# Altium schematic sheet BMS Master.SchDoc
size A4; SheetNumber: 1; SheetTotal: 6
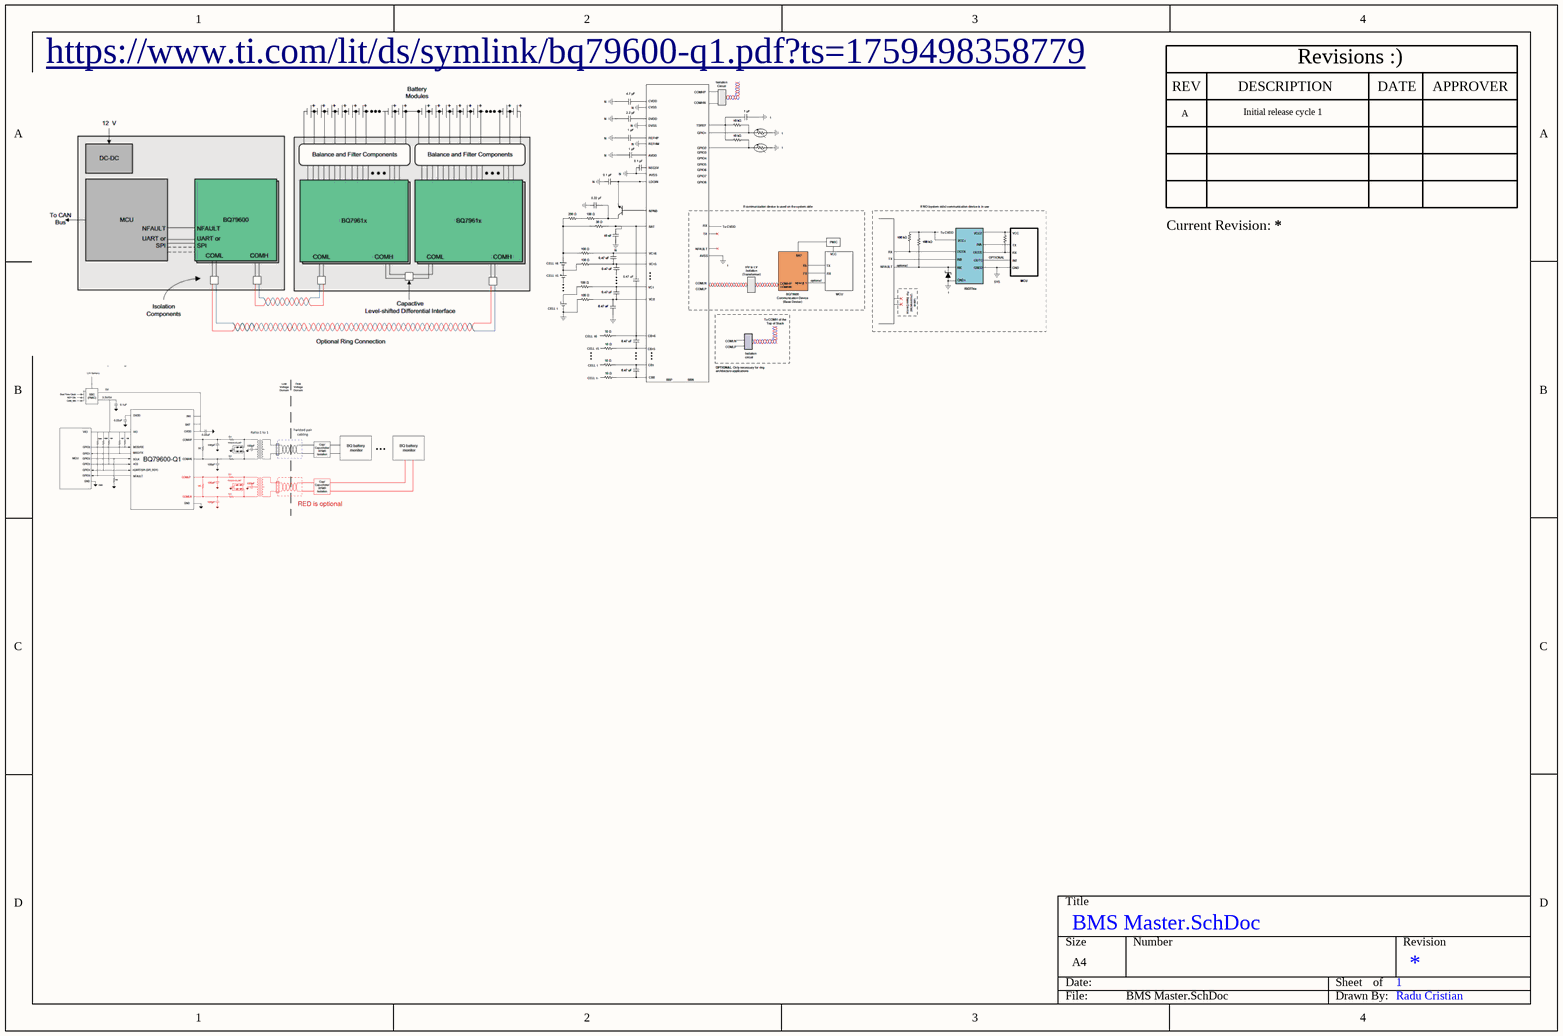
[diagram p0: BMS Master.SchDoc]

## Notes on the sheet
- https://www.ti.com/lit/ds/symlink/bq79600-q1.pdf?ts=1759498358779
- REV
- A
- DESCRIPTION
- Initial release cycle 1
- Revisions :)
- DATE
- APPROVER
- Current Revision:
- Radu Cristian